# Altium schematic sheet HeartRate.SchDoc
size A; SheetNumber: 2; SheetTotal: 7
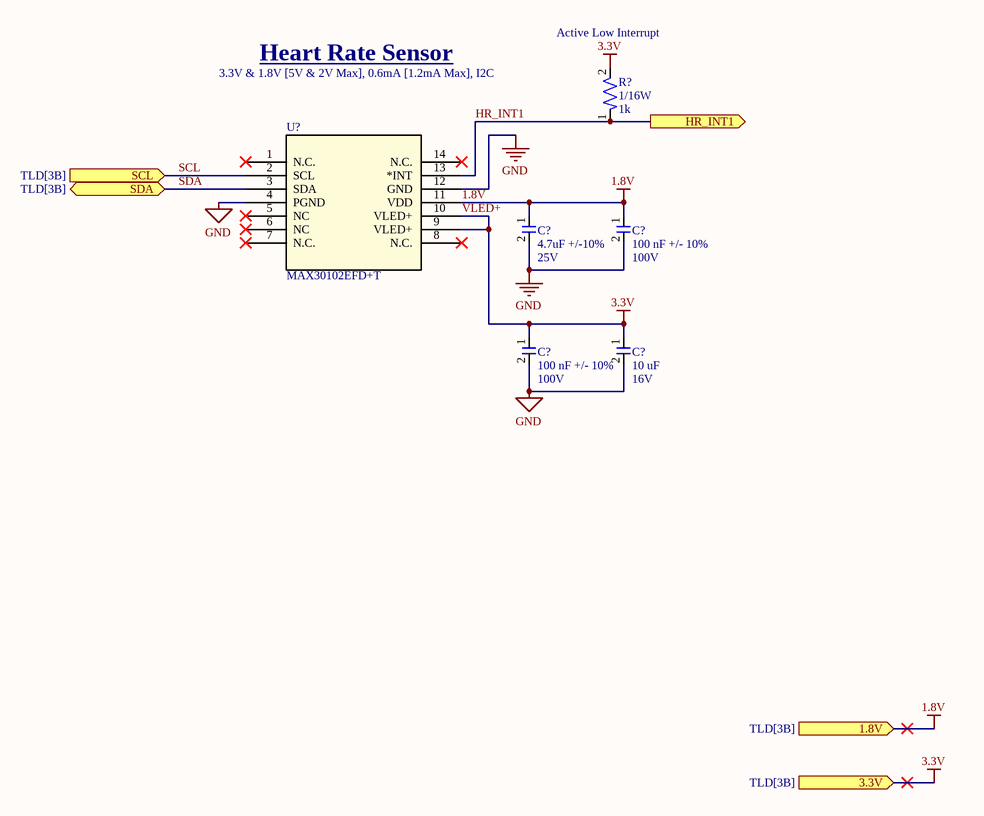
[diagram p0: HeartRate.SchDoc]

## Parts
(Parts that share a designator on the sheet are numbered #1, #2 ... from top to bottom, then left to right.)
C?#1  Capacitance: 4.7uF +/-10%  Voltage Rating: 25V  [CAP-0603]  (hidden comment: TMK107BBJ475KA-T)
C?#2  Capacitance: 100 nF +/- 10%  Voltage: 100V  [CAP-0603]  (hidden comment: CC0603KRX7R0BB104)
C?#3  Capacitance: 100 nF +/- 10%  Voltage: 100V  [CAP-0603]  (hidden comment: CC0603KRX7R0BB104)
C?#4  Capacitance: 10 uF  Voltage Rating: 16V  [CAP-0805]  (hidden comment: CL21A106KOQNNNE)
R?  Power: 1/16W  Resistance: 1k  [RES-0402]  (hidden comment: RC0402FR-071KL)
U?  MAX30102EFD+T  [XDCR_MAX30101EFD+]

## Ports
1.8V (in, see TLD[3B]), 3.3V (in, see TLD[3B]), HR_INT1 (out), SCL (in, see TLD[3B]), SDA (bidir, see TLD[3B])

## Nets
1.8V: C?#1.1 C?#2.1 U?.11(VDD) ; port 1.8V
GND: C?#1.2 C?#2.2 C?#3.2 C?#4.2 U?.4(PGND) U?.12(GND)
VLED+: C?#3.1 C?#4.1 R?.2 U?.9(VLED+) U?.10(VLED+) ; port 3.3V  [also labelled 3.3V]
HR_INT1: R?.1 U?.13(*INT) ; port HR_INT1
SCL: U?.2(SCL) ; port SCL
SDA: U?.3(SDA) ; port SDA

Not connected (* = marked no-connect by the designer): U? 1(N.C.)* 5(NC)* 6(NC)* 7(N.C.)* 8(N.C.)* 14(N.C.)*

## Notes on the sheet
- Heart Rate Sensor
- (near R?) Active Low Interrupt
- 3.3V & 1.8V [5V & 2V Max], 0.6mA [1.2mA Max], I2C

## Library data of the parts
C?#1 = CAP-4.7U-0001: 4.7 µF ±10% 25V Ceramic Capacitor X5R 0603 (1608 Metric); Manufacturer: Taiyo Yuden; Assembled?: no; Manufacturer Part Number: TMK107BBJ475KA-T; Temperature Coefficient: X5R; Package Size: 0603
C?#2 C?#3 = CAP-100N-0002-JLC: 100V 100nF X7R ±10% 0603 Multilayer Ceramic Capacitors MLCC - SMD/SMT ROHS; assembled?: yes; JLC Part Number: C113803
C?#4 = CAP-10U-0002: 10 µF ±10% 16V Ceramic Capacitor X7R 0805 (2012 Metric); Package Size: 0805
R? = RES-1k-0001: RES 1K OHM 1% 1/16W 0402; Tolerance: 1%; Size: 0402; ComponentLink1Description: Datasheet; ComponentLink1URL: https://www.yageo.com/upload/media/product/products/datasheet/rchip/PYu-RC_Group_51_RoHS_L_12.pdf
U? = IC-PulseOximeterHeartRate: Pulse Oximeter and Heart Rate Sensor Digital Output; MF: Maxim Integrated Products; Digi-Key_Part_Number: MAX30102EFD+TTR-ND; Check_prices: https://www.snapeda.com/parts/MAX30102EFD+T/Maxim+Integrated/view-part/?ref=eda; MP: MAX30102EFD+T; Package: None; SnapEDA_Link: https://www.snapeda.com/parts/MAX30102EFD+T/Maxim+Integrated/view-part/?ref=snap; Value: *; Purchase-URL: https://pricing.snapeda.com/search/part/MAX30102EFD+T/?ref=eda; ComponentLink1Description: Datasheet; ComponentLink1URL: https://cdn.sparkfun.com/assets/8/3/c/3/2/MAX30102_Datasheet.pdf